# Altium schematic sheet LEFT_AR0234.SchDoc: =project_title
size Tabloid; PageSetup: Record=PageOptions|CenterHorizontal=True|CenterVertical=True|PrintScale=0.71|XCorrection=1.00|YCorrection=1.00|PrintKind=0|BorderSize=5000000|LeftOffset=0|BottomOffset=0|Orientation=2|PaperLength=1000|PaperWidth=1000|Scale=100|PaperSource=7|PrintQuality=-4|MediaType=1|DitherType=10|PrintScaleMode=1|PaperKind=A4; CompanyName: Luxonis Holding; Organization: Luxonis Holding; Address1: 1925 Harmony Park Drive; Address2: Westminster, CO; Address3: 80234; Address4: United States; SheetNumber: 6; SheetTotal: 11
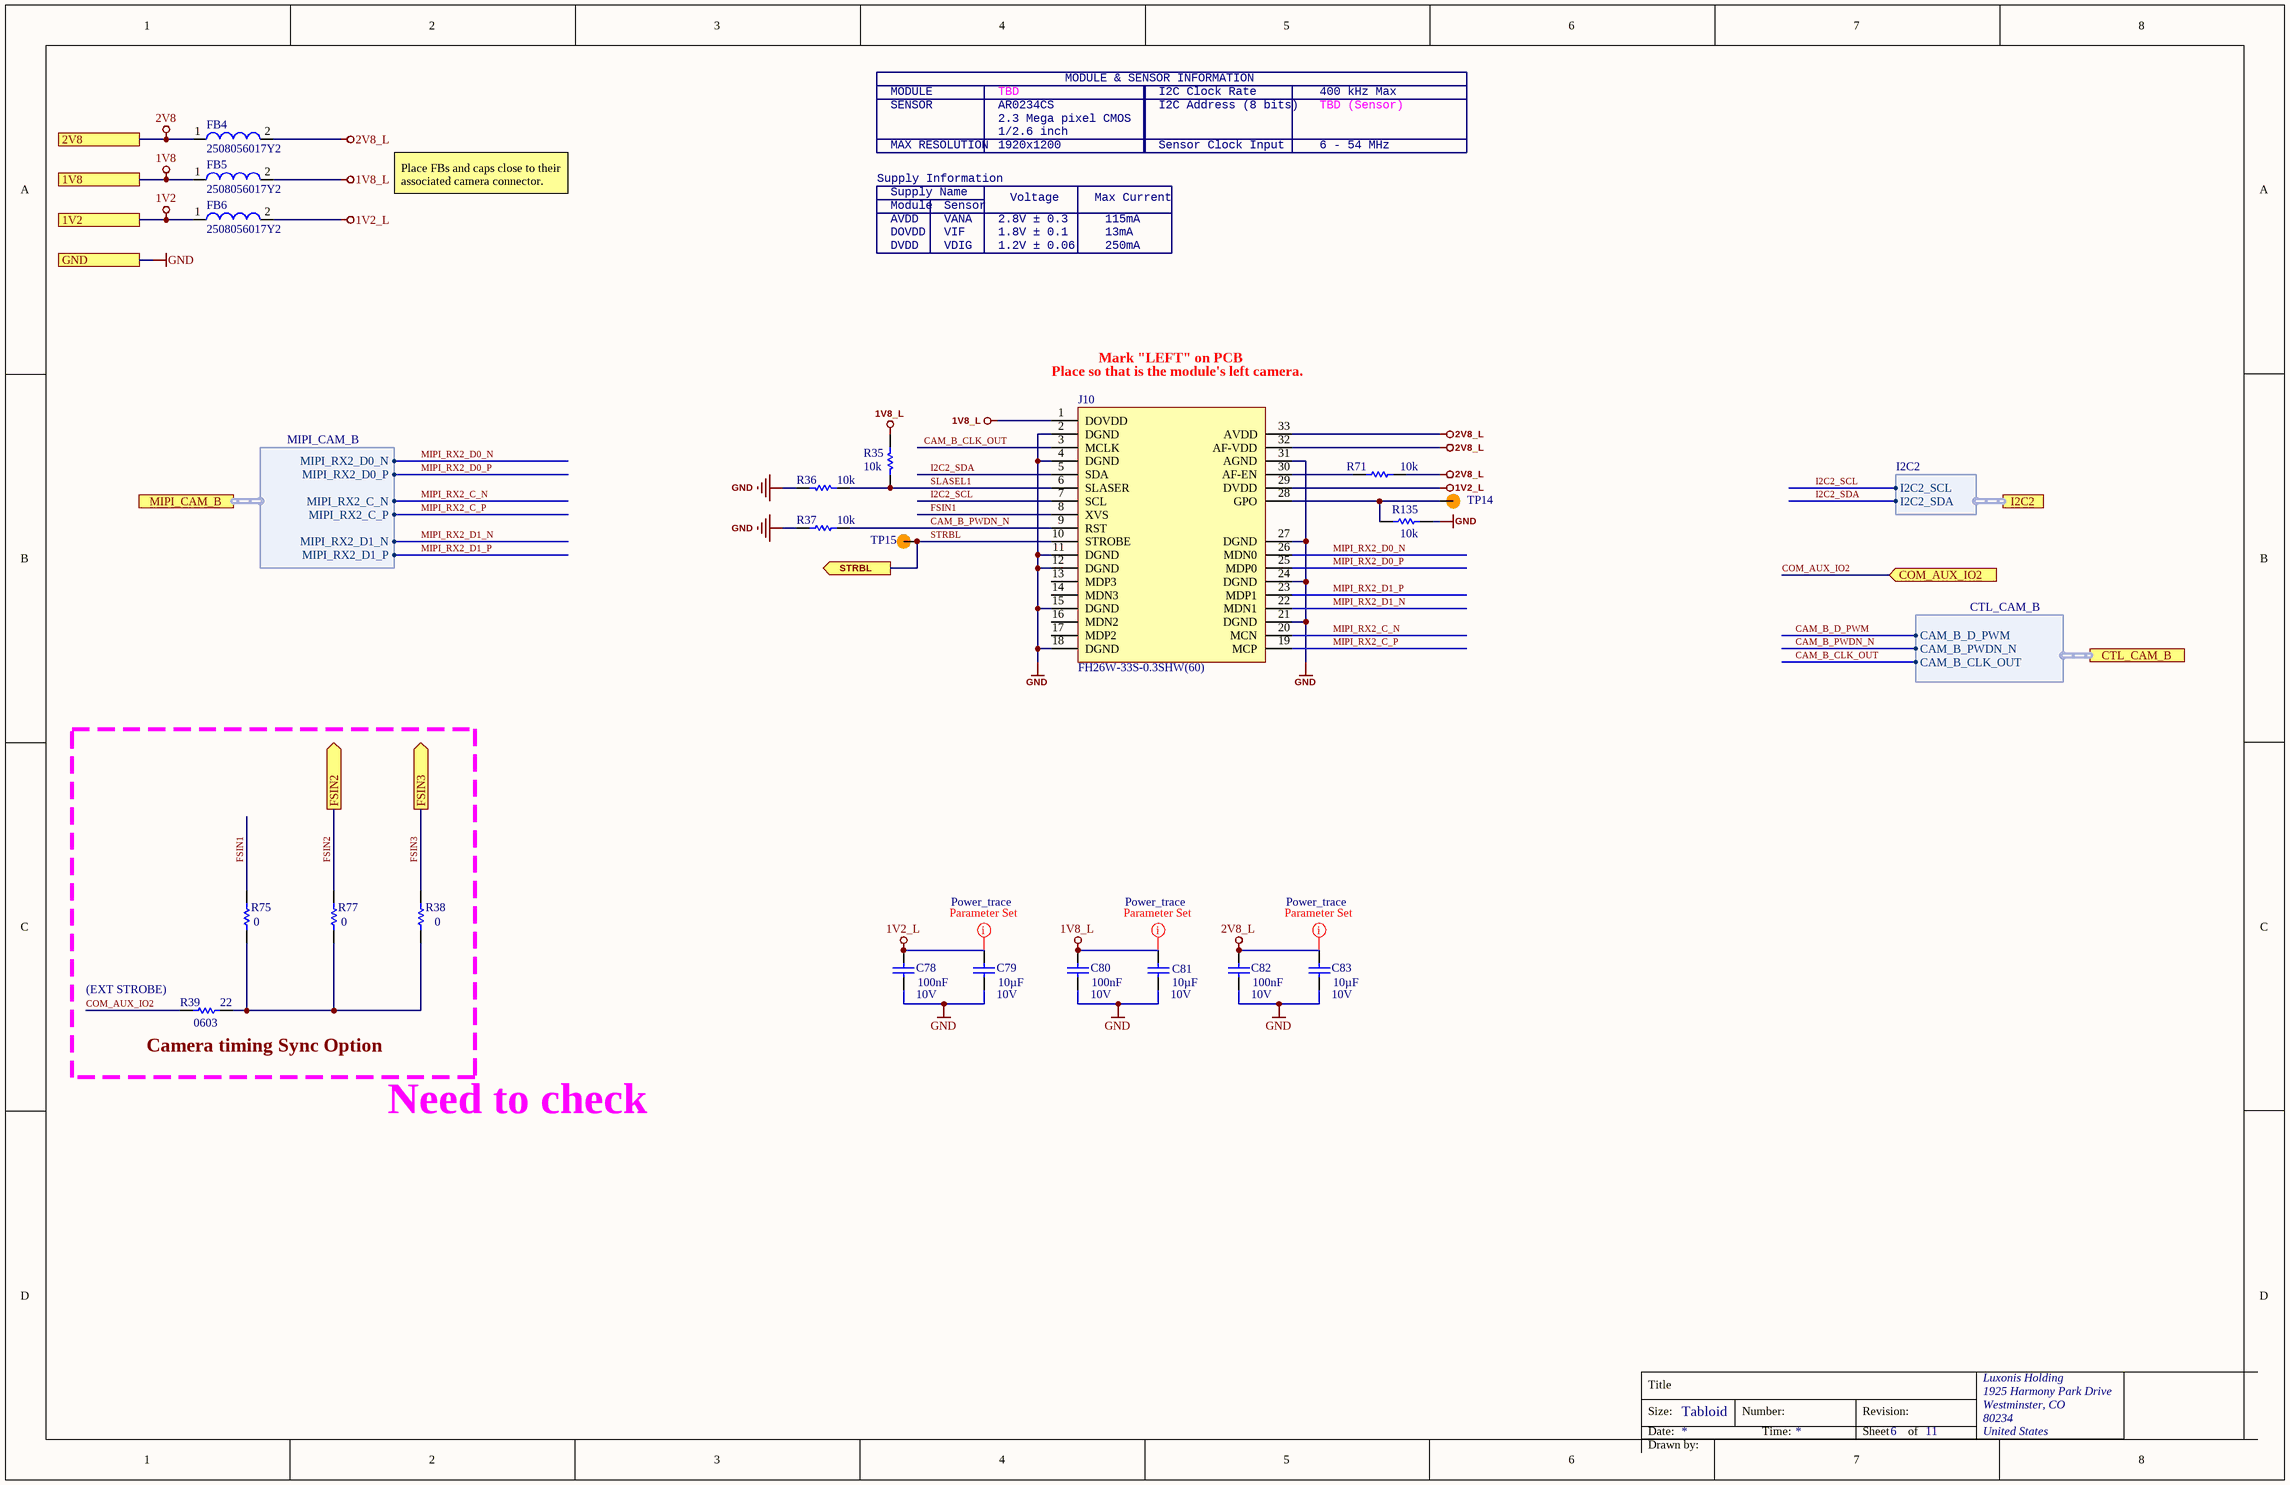
[diagram p0: LEFT_AR0234.SchDoc]

## Parts
C78  value 100nF  Voltage Rating: 10V  [CAPC0402(1005)70_L]  (hidden comment: GRM155R71A104JA01D)
C79  value 10µF  Voltage Rating: 10V  [CAPC0603(1608)100_L]  (hidden comment: GRM188R61A106ME69D)
C80  value 100nF  Voltage Rating: 10V  [CAPC0402(1005)70_L]  (hidden comment: GRM155R71A104JA01D)
C81  value 10µF  Voltage Rating: 10V  [CAPC0603(1608)100_L]  (hidden comment: GRM188R61A106ME69D)
C82  value 100nF  Voltage Rating: 10V  [CAPC0402(1005)70_L]  (hidden comment: GRM155R71A104JA01D)
C83  value 10µF  Voltage Rating: 10V  [CAPC0603(1608)100_L]  (hidden comment: GRM188R61A106ME69D)
FB4  2508056017Y2  [2508056017Y2]
FB5  2508056017Y2  [2508056017Y2]
FB6  2508056017Y2  [2508056017Y2]
J10  FH26W-33S-0.3SHW(60)  [FH26W-33S-0.3SHW(60)]
R35  value 10k  [RESC0402(1005)_L]  (hidden comment: RC0402FR-1310KL)
R36  value 10k  [RESC0402(1005)_L]  (hidden comment: RC0402FR-1310KL)
R37  value 10k  [RESC0402(1005)_L]  (hidden comment: RC0402FR-1310KL)
R38  value 0  [RESC0603(1608)_L]  (hidden comment: CRCW06030000Z0EA)
R39  value 22  Case/Package: 0603  [RESC0603(1608)_L]  (hidden comment: RC0603FR-0722RL)
R71  value 10k  [RESC0402(1005)_L]  (hidden comment: RC0402FR-1310KL)
R75  value 0  [RESC0603(1608)_L]  (hidden comment: CRCW06030000Z0EA)
R77  value 0  [RESC0603(1608)_L]  (hidden comment: CRCW06030000Z0EA)
R135  value 10k  [RESC0402(1005)_L]  (hidden comment: RC0402FR-1310KL)
TP14  TEST_POINT  [TP100_200_NS]  (value not drawn)  (no BOM)
TP15  TEST_POINT  [TP100_200_NS]  (value not drawn)  (no BOM)

## Blocks framed on the sheet
Camera timing Sync Option: R38 R39 R75 R77

## Ports
1V2, 1V8, 2V8, COM_AUX_IO2 (in), CTL_CAM_B (harness CTL_CAM_B), FSIN2 (out), FSIN3 (out), GND, I2C2 (harness I2C2), MIPI_CAM_B (harness MIPI_CAM_B), STRBL (out)

## Harnesses
I2C2: I2C2_SDA, I2C2_SCL
MIPI_CAM_B: MIPI_RX2_D1_P, MIPI_RX2_D1_N, MIPI_RX2_D0_N, MIPI_RX2_D0_P, MIPI_RX2_C_N, MIPI_RX2_C_P
CTL_CAM_B: CAM_B_CLK_OUT, CAM_B_PWDN_N, CAM_B_D_PWM

## Nets
1V2: FB6.1 ; port 1V2
1V2_L: C78.2 C79.2 FB6.2 J10.29(DVDD)
1V8: FB5.1 ; port 1V8
1V8_L: C80.2 C81.2 FB5.2 J10.1(DOVDD) R35.1
2V8: FB4.1 ; port 2V8
2V8_L: C82.2 C83.2 FB4.2 J10.32(AF-VDD) J10.33(AVDD) R71.2
GND: C78.1 C79.1 C80.1 C81.1 C82.1 C83.1 J10.2(DGND) J10.4(DGND) J10.11(DGND) J10.12(DGND) J10.15(DGND) J10.18(DGND) J10.21(DGND) J10.24(DGND) J10.27(DGND) J10.31(AGND) R36.1 R37.2 R135.2 ; port GND
CAM_B_CLK_OUT: J10.3(MCLK) ; port CTL_CAM_B.CAM_B_CLK_OUT
CAM_B_D_PWM: port CTL_CAM_B.CAM_B_D_PWM
CAM_B_PWDN_N: J10.9(RST) R37.1 ; port CTL_CAM_B.CAM_B_PWDN_N
COM_AUX_IO2: R39.2 ; port COM_AUX_IO2
FSIN1: J10.8(XVS) R75.2
FSIN2: R77.2 ; port FSIN2
FSIN3: R38.2 ; port FSIN3
I2C2_SCL: J10.7(SCL) ; port I2C2.I2C2_SCL
I2C2_SDA: J10.5(SDA) ; port I2C2.I2C2_SDA
MIPI_RX2_C_N: J10.20(MCN) ; port MIPI_CAM_B.MIPI_RX2_C_N
MIPI_RX2_C_P: J10.19(MCP) ; port MIPI_CAM_B.MIPI_RX2_C_P
MIPI_RX2_D0_N: J10.26(MDN0) ; port MIPI_CAM_B.MIPI_RX2_D0_N
MIPI_RX2_D0_P: J10.25(MDP0) ; port MIPI_CAM_B.MIPI_RX2_D0_P
MIPI_RX2_D1_N: J10.22(MDN1) ; port MIPI_CAM_B.MIPI_RX2_D1_N
MIPI_RX2_D1_P: J10.23(MDP1) ; port MIPI_CAM_B.MIPI_RX2_D1_P
SLASEL1: J10.6(SLASER) R35.2 R36.2
STRBL: J10.10(STROBE) TP15.1 ; port STRBL
NetJ10_28: J10.28(GPO) R135.1 TP14.1
NetJ10_30: J10.30(AF-EN) R71.1
NetR38_1: R38.1 R39.1 R75.1 R77.1

Not connected (* = marked no-connect by the designer): J10 13(MDP3) 14(MDN3) 16(MDN2) 17(MDP2)

## Layout directives
net class Power_trace: 1V2_L, 1V8_L, 2V8_L

## Notes on the sheet
- MODULE
- TBD
- MODULE & SENSOR INFORMATION
- I2C Clock Rate
- 400 kHz Max
- SENSOR
- MAX RESOLUTION
- 2.3 Mega pixel CMOS
- 1920x1200
- AR0234CS
- 1/2.6 inch
- I2C Address (8 bits)
- Sensor Clock Input
- TBD (Sensor)
- 6 - 54 MHz
- Place FBs and caps close to their associated camera connector.
- Supply Information
- AVDD
- Supply Name
- Module
- VANA
- Sensor
- 2.8V ± 0.3
- Voltage
- Max Current
- 115mA
- DOVDD
- DVDD
- VIF
- VDIG
- 1.8V ± 0.1
- 1.2V ± 0.06
- 13mA
- 250mA
- Mark "LEFT" on PCB
- (near J10) Place so that is the module's left camera.
- (near R39) (EXT STROBE)
- Need to check
- Title
- Size:
- Date:
- Tabloid
- Number:
- Time:
- Revision:
- Sheet
- of
- Drawn by:

## Library data of the parts
C78 C80 C82 = CMP-108-000015-5: CAP CER 0.1UF 10V X7R 0402 5%; Manufacturer 1: Murata; Manufacturer Part Number 1: GRM155R71A104JA01D; Case/Package: 0402; Min Operating Temperature: -55°C; Max Operating Temperature: 125°C; Tolerance: 5%; Dielectric: X7R; Length: 1mm; Height: 0.5mm; Width: 0.02inch; Depth: 0.5mm; ComponentLink1URL: https://datasheet.ciiva.com/5411/product-5411135.pdf?src-supplier=Mouser; ComponentLink1Description: https://datasheet.ciiva.com/5411/product-5411135.pdf?src-supplier=Mouser; ComponentLink2URL: https://datasheet.ciiva.com/11618/c02e-11618821.pdf?src-supplier=Avnet; ComponentLink2Description: https://datasheet.ciiva.com/11618/c02e-11618821.pdf?src-supplier=Avnet; Design Item ID: GRM155R71A104JA01D; Mounting Technology: SMT
C79 C81 C83 = CMP-004-000018-4: CAP CER 10UF 10V X5R 0603 20%; Manufacturer 1: Murata; Manufacturer Part Number 1: GRM188R61A106ME69D; Case/Package: 0603; Min Operating Temperature: -55°C; Max Operating Temperature: 85°C; Tolerance: 20%; Dielectric: X5R; Length: 1.6mm; Height: 0.8mm; Width: 0.8mm; Depth: 0.8mm; ComponentLink1URL: http://www.mouser.com/ds/2/281/c02e-2905.pdf?src-supplier=Mouser; ComponentLink1Description: http://www.mouser.com/ds/2/281/c02e-2905.pdf?src-supplier=Mouser; ComponentLink2URL: http://components.arrow.com/part/dataview/0323_06119472?src-supplier=Arrow+Europe; ComponentLink2Description: http://components.arrow.com/part/dataview/0323_06119472?src-supplier=Arrow+Europe; ComponentLink3URL: http://www.farnell.com/datasheets/2048014.pdf?src-supplier=Farnell; ComponentLink3Description: http://www.farnell.com/datasheets/2048014.pdf?src-supplier=Farnell; ComponentLink4URL: http://www.farnell.com/datasheets/1872210.pdf?src-supplier=Farnell; ComponentLink4Description: http://www.farnell.com/datasheets/1872210.pdf?src-supplier=Farnell; ComponentLink5URL: http://search.murata.co.jp/Ceramy/image/img/A01X/G101/ENG/GRM188R61A106ME69-01.pdf?src-supplier=Digi-Key; ComponentLink5Description: http://search.murata.co.jp/Ceramy/image/img/A01X/G101/ENG/GRM188R61A106ME69-01.pdf?src-supplier=Digi-Key; ComponentLink6URL: http://www.farnell.com/datasheets/1872210.pdf?src-supplier=Newark; ComponentLink6Description: http://www.farnell.com/datasheets/1872210.pdf?src-supplier=Newark; ComponentLink7URL: http://www.farnell.com/datasheets/2048014.pdf?src-supplier=Element14; ComponentLink7Description: http://www.farnell.com/datasheets/2048014.pdf?src-supplier=Element14; ComponentLink8URL: http://www.farnell.com/datasheets/2048014.pdf?src-supplier=Newark; ComponentLink8Description: http://www.farnell.com/datasheets/2048014.pdf?src-supplier=Newark; Design Item ID: GRM188R61A106ME69D; Mounting Technology: SMT
FB4-FB6 = CMP-082-000000-2: FERRITE BEAD, 0.1OHM, 2A, 0805, 600R/100MHz; Manufacturer 1: Fair-Rite; Tolerance: 25%; Manufacturer Part Number 1: 2508056017Y2; Case/Package: 0805; Current Rating: 2A
J10 = CMP-002-00090-3: FFC/FPC Connector, 33 Contact(s), 1 Row(s), Female, Right Angle, Surface Mount Terminal; Manufacturer 1: Hirose; Manufacturer Part Number 1: FH26W-33S-0.3SHW(60); RoHS: Yes; Category: FFC / FPC; Stock 1: 627; Pricing 1: 1=1,78000, 10=1,61700, 25=1,51800, 50=1,45200, 100=1,38600, 250=1,25400, 500=1,15500, 1000=0,99000, 2500=0,92400 (USD); ComponentLink1URL: https://datasheet.ciiva.com:443/pdfs/VipMasterIC/IC/HIRO/HIRO-S-A0007913874/HIRO-S-A0008593114-1.pdf?src-supplier=IHS+Markit; ComponentLink1Description: https://datasheet.ciiva.com:443/pdfs/VipMasterIC/IC/HIRO/HIRO-S-A0007913874/HIRO-S-A0008593114-1.pdf?src-supplier=IHS+Markit; ComponentLink2URL: https://www.hirose.com/product/en/download_file/key_name/FH26/category/Catalog/doc_file_id/49355/?file_category_id=4&item_id=298&is_series=1&src-supplier=Digi-Key; ComponentLink2Description: https://www.hirose.com/product/en/download_file/key_name/FH26/category/Catalog/doc_file_id/49355/?file_category_id=4&item_id=298&is_series=1&src-supplier=Digi-Key; ComponentLink3URL: https://www.hirose.com/product/download/?distributor=digikey&amp;type=2d&amp;lang=en&amp;num=FH26W-13S-0.3SHW(60)&src-supplier=Digi-Key; ComponentLink3Description: https://www.hirose.com/product/download/?distributor=digikey&amp;type=2d&amp;lang=en&amp;num=FH26W-13S-0.3SHW(60)&src-supplier=Digi-Key; Design Item ID: FH26W-33S-0.3SHW(60); Pins: 33; Source: LuxonisMaster.SchLib
R35-R37 R71 R135 = CMP-115-000004-8: RES SMD 10K OHM 1% 1/16W 0402; Manufacturer 1: Yageo; Temperature Coefficient: 100ppm/°C; Power Rating: 62.5mW; Voltage Rating: 50V; Manufacturer Part Number 1: RC0402FR-1310KL; Case/Package: 0402; Min Operating Temperature: -55°C; Max Operating Temperature: 155°C; Tolerance: 1%; Design Item ID: RC0402FR-1310KL
R38 R75 R77 = CMP-115-000011-7: RES SMD 0 OHM 5% 1/10W 0603; Manufacturer 1: Vishay; Manufacturer Part Number 1: CRCW0603-0000Z0EA; Power Rating: 100mW; Voltage Rating: 75V; Temperature Coefficient: 100ppm/°C; Case/Package: 0603; Min Operating Temperature: -55°C; Max Operating Temperature: 155°C; Tolerance: 5%; Design Item ID: CRCW06030000Z0EA
R39 = CMP-013-000020-8: RES SMD 22 OHM 1% 1/10W 0603; Manufacturer 1: Yageo; Power Rating: 100mW; Voltage Rating: 50V; Manufacturer Part Number 1: RC0603FR-0722RL; Min Operating Temperature: -55°C; Max Operating Temperature: 155°C; Tolerance: 1%; Design Item ID: RC0603FR-0722RL
TP14 TP15 = CMP-015-000000-2: Manufacturer Part Number 1: /; Design Item ID: TEST_POINT; Source: LuxonisMaster.SchLib